# EAGLE design square (EAGLE 6.5.0)
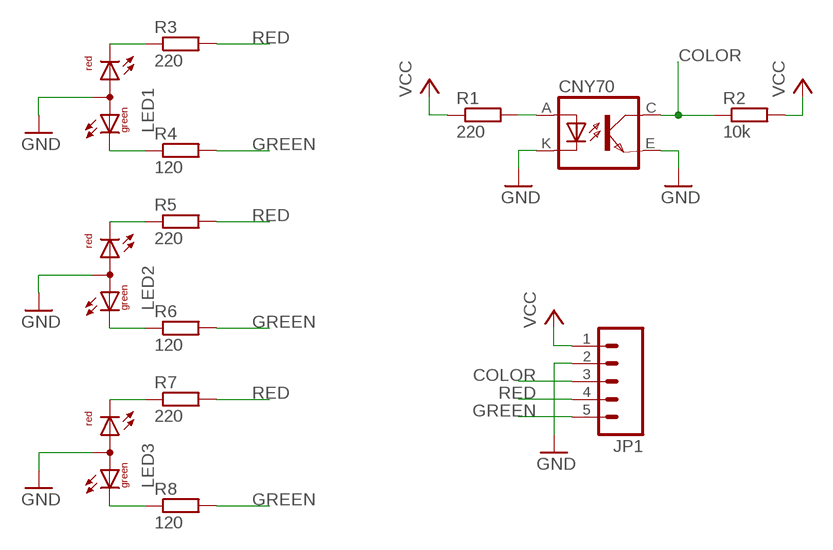
[diagram p0: schematic, sheet 1]

## Parts
CNY70  CNY70  [4]
JP1  M05PTH  [1X05]
LED1  L-115WEGW-CA  [DUOLED-A-3MM]
LED2  L-115WEGW-CA  [DUOLED-A-3MM]
LED3  L-115WEGW-CA  [DUOLED-A-3MM]
R1  220  R-EU_0204/7  [0204/7]
R2  10k  R-EU_0204/7  [0204/7]
R3  220  R-EU_0204/7  [0204/7]
R4  120  R-EU_0204/7  [0204/7]
R5  220  R-EU_0204/7  [0204/7]
R6  120  R-EU_0204/7  [0204/7]
R7  220  R-EU_0204/7  [0204/7]
R8  120  R-EU_0204/7  [0204/7]

## Nets
COLOR: CNY70.C(COL) JP1.3 R2.1
GND: CNY70.E(EMI) CNY70.K(C) JP1.2 LED1.2(A) LED2.2(A) LED3.2(A)
GREEN: JP1.5 R4.2 R6.2 R8.2
N$2: CNY70.A R1.2
N$3: LED1.3(CR) R3.1
N$4: LED2.3(CR) R5.1
N$5: LED3.3(CR) R7.1
N$6: LED2.1(CG) R6.1
N$7: LED1.1(CG) R4.1
N$8: LED3.1(CG) R8.1
RED: JP1.4 R3.2 R5.2 R7.2
VCC: JP1.1 R1.1 R2.2

## Library data of the parts
CNY70 = cny70:CNY70
JP1 = SparkFun-Connectors:M05: Header 5 Standard 5-pin 0.1" header. Use with straight break away headers (SKU : PRT-00116), right angle break away headers (PRT-00553), swiss pins (PRT-00743), machine pins (PRT-00117), and female headers (PRT-00115). Molex polarized connector foot print use with SKU : PRT-08230 with associated crimp pins and housings.
LED1-LED3 = led:L-115WEGW-CA: T-1(3mm) BI-COLOR INDICATOR LAMP Source: Kingbright .. 2_colour_led_.pdf
R1-R8 = resistor:R-EU_: RESISTOR, European symbol

## Board
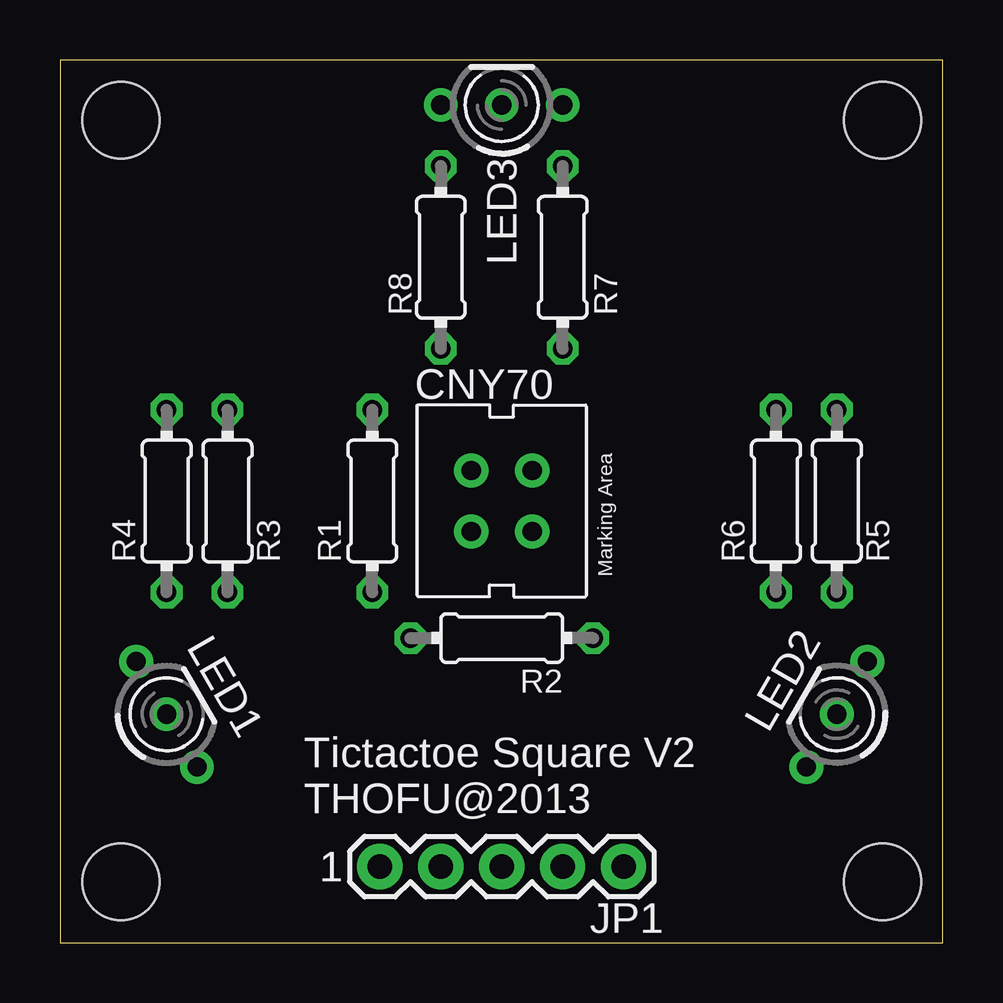
[diagram p1: board, top side]
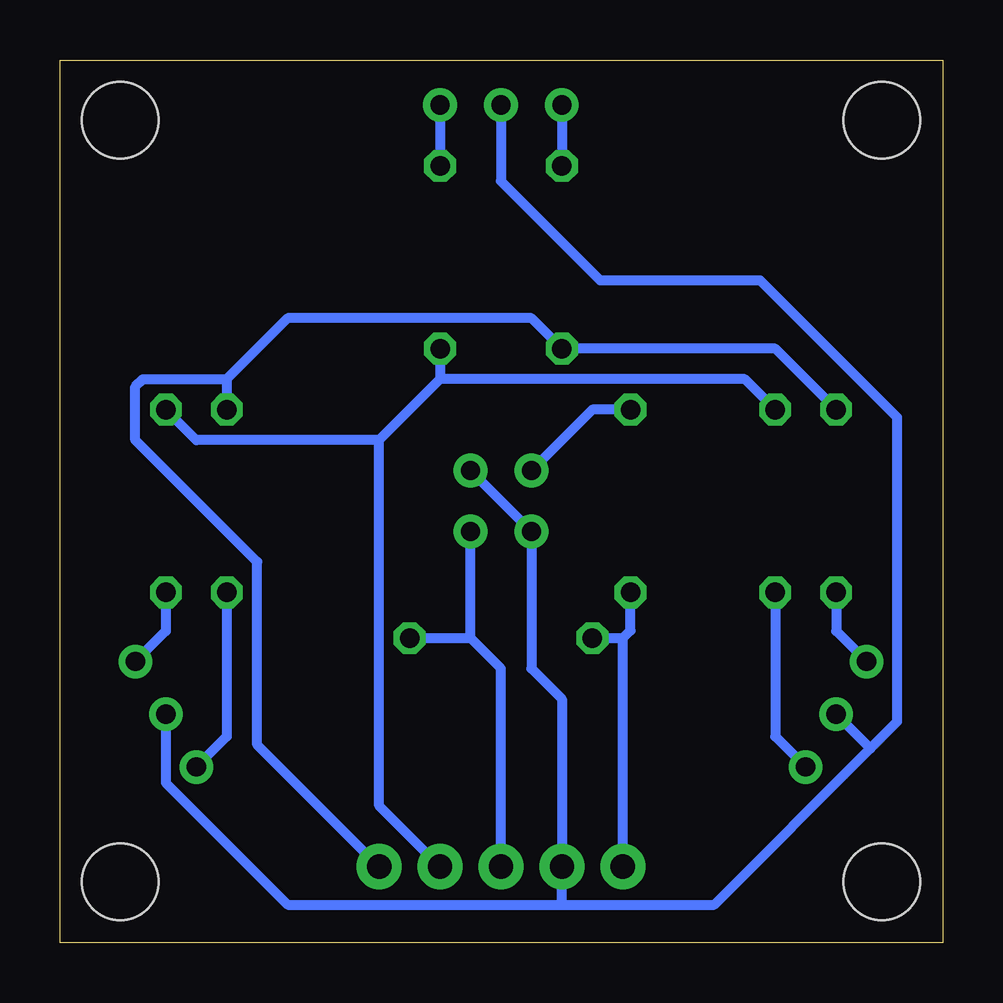
[diagram p2: board, bottom side, seen from below]

Size 36.8 x 36.8 mm. Coordinates in mm from the lower left corner, seen from the top.
Outline: 0,0 36.8,0 36.8,36.8 0,36.8 0,0
Copper layers (1*16): Top 0.035mm / dielectric 1.5mm / Bottom 0.035mm
Design rules "default": minimum track width 10mil, minimum drill 24mil, track to track 8mil, track to pad 8mil, pad to pad 8mil, via to via 8mil, smd to smd 8mil, copper to edge 40mil, drill to drill 8mil, minimum pad ring 10mil, minimum via ring 8mil, stop-mask expansion 4mil, vias tented up to drill 0mil, thermal gap 10mil
Holes 3.2 mm at 2.54,34.29 2.54,2.54 34.29,2.54 34.29,34.29

### Footprints (pad centres in the part's own frame; a part is rotated, then mirrored left to right if it is on the bottom)
4 = drill 0.8 pad 1.422: A -1.27,1.27; C 1.27,-1.27; E 1.27,1.27; K -1.27,-1.27
1X05 = drill 1.016 pad 1.88: 1 0,0; 2 2.54,0; 3 5.08,0; 4 7.62,0; 5 10.16,0
DUOLED-A-3MM = drill 0.8 pad 1.4: 1 -2.54,0; 2 0,0; 3 2.54,0
0204/7 = drill 0.813 octagon: 1 -3.81,0; 2 3.81,0

### Placement (x,y rotation side)
CNY70  18.41,18.41 0 top
JP1  13.34,3.17 0 top
LED1  4.45,9.53 300 top
LED2  32.38,9.53 60 top
LED3  18.41,34.92 0 top
R1  13.02,18.41 90 top
R2  18.41,12.7 180 top
R3  6.99,18.41 90 top
R4  4.45,18.41 90 top
R5  32.38,18.41 90 top
R6  29.84,18.41 90 top
R7  20.95,28.57 270 top
R8  15.88,28.57 270 top

### Tracks (layer width: path | path; a pad name or v marks a point on that pad's centre or on a via)
COLOR
  Bottom 0.406: JP1.3 18.41,11.43 19.68,12.7 | 19.68,12.7 CNY70.C | R2.1 19.68,12.7
GND
  Bottom 0.406: CNY70.E CNY70.K 17.14,11.43 15.88,10.16 JP1.2 15.88,1.59 | 15.88,1.59 9.53,1.59 3.02,8.1 | 3.02,8.1 1.91,9.21 1.91,21.91 7.62,27.62 14.29,27.62 18.41,31.75 LED3.2 | LED2.2 32.38,6.67 27.3,1.59 15.88,1.59 | LED1.2 3.02,8.1
GREEN
  Bottom 0.406: R4.2 6.99,24.77 R8.2 17.14,26.04 27.3,26.04 29.84,23.5 | 29.84,23.5 R6.2 | JP1.5 28.57,8.26 28.57,15.88 33.66,20.95 33.66,23.18 33.34,23.5 29.84,23.5
N$2
  Bottom 0.406: R1.2 14.61,22.23 CNY70.A
N$3
  Bottom 0.406: R3.1 6.99,8.6 LED1.3
N$4
  Bottom 0.406: R5.1 32.38,12.99 LED2.3
N$5
  Bottom 0.406: LED3.3 R7.1
N$6
  Bottom 0.406: R6.1 29.84,8.6 LED2.1
N$7
  Bottom 0.406: R4.1 4.45,12.99 LED1.1
N$8
  Bottom 0.406: LED3.1 R8.1
RED
  Bottom 0.406: R3.2 8.26,23.5 20.95,23.5 | R7.2 20.95,23.5 | 20.95,23.5 23.5,20.95 | 23.5,20.95 31.11,20.95 R5.2 | JP1.4 23.5,5.71 23.5,20.95
VCC
  Bottom 0.406: R2.2 13.34,12.7 | 13.34,12.7 13.02,13.02 R1.1 | JP1.1 13.34,12.7

### Text on the board
tNames: Tictactoe Square V2 / THOFU@2013 | 1